# EAGLE design dualKatana (EAGLE 9.6.2)
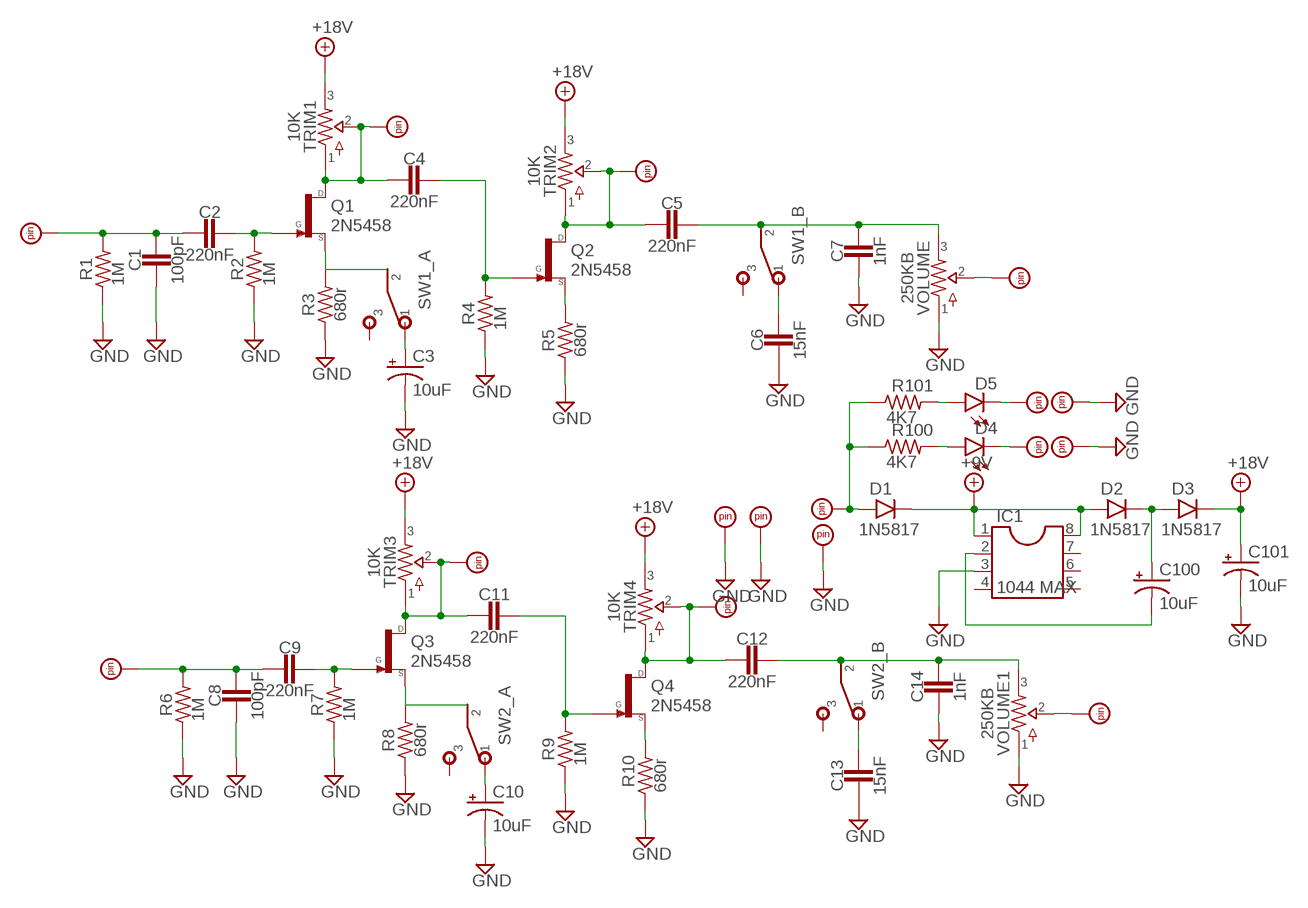
[diagram p0: schematic, sheet 1]

## Parts
C1  100pF  CAP.3  [0.2".MED]
C2  220nF  CAP.3  [0.2".MED]
C3  10uF  0501  [050_020_1]
C4  220nF  CAP.3  [0.2".MED]
C5  220nF  CAP.3  [0.2".MED]
C6  15nF  CAP.3  [0.2".MED]
C7  1nF  CAP.3  [0.2".MED]
C8  100pF  CAP.3  [0.2".MED]
C9  220nF  CAP.3  [0.2".MED]
C10  10uF  0501  [050_020_1]
C11  220nF  CAP.3  [0.2".MED]
C12  220nF  CAP.3  [0.2".MED]
C13  15nF  CAP.3  [0.2".MED]
C14  1nF  CAP.3  [0.2".MED]
C100  10uF  0501  [050_020_1]
C101  10uF  0501  [050_020_1]
D1  1N5817  DO41.3  [DO41-3]
D2  1N5817  DO41.3  [DO41-3]
D3  1N5817  DO41.3  [DO41-3]
D4  LED3MM  [LED3MM]
D5  LED3MM  [LED3MM]
IC1  1044 MAX  DIL8  [DIL08]
Q1  2N5458  2N5457  [TO92]
Q2  2N5458  2N5457  [TO92]
Q3  2N5458  2N5457  [TO92]
Q4  2N5458  2N5457  [TO92]
R1  1M  RESISTORS.3B  [R0207/3]
R2  1M  RESISTORS.3B  [R0207/3]
R3  680r  RESISTORS.3B  [R0207/3]
R4  1M  RESISTORS.3B  [R0207/3]
R5  680r  RESISTORS.3B  [R0207/3]
R6  1M  RESISTORS.3B  [R0207/3]
R7  1M  RESISTORS.3B  [R0207/3]
R8  680r  RESISTORS.3B  [R0207/3]
R9  1M  RESISTORS.3B  [R0207/3]
R10  680r  RESISTORS.3B  [R0207/3]
R100  4K7  RESISTORS.3B  [R0207/3]
R101  4K7  RESISTORS.3B  [R0207/3]
SW1  DPDTDPDT_3  [DPDT2_PCB]
SW2  DPDTDPDT_3  [DPDT2_PCB]
TRIM1  10K  TRIMMERTRIM3  [TRIM3]
TRIM2  10K  TRIMMERTRIM3  [TRIM3]
TRIM3  10K  TRIMMERTRIM3  [TRIM3]
TRIM4  10K  TRIMMERTRIM3  [TRIM3]
U$1  PADS.RND_NL  [PAD2]
U$2  PADS.RND_NL  [PAD2]
U$3  PADS.RND_NL  [PAD2]
U$4  PADS.RND_NL  [PAD2]
U$5  PADS.RND_NL  [PAD2]
U$6  PADS.RND_NL  [PAD2]
U$7  PADS.RND_NL  [PAD2]
U$8  PADS.RND_NL  [PAD2]
U$9  PADS.RND_NL  [PAD2]
U$10  PADS.RND_NL  [PAD2]
U$11  PADS.RND_NL  [PAD2]
U$12  PADS.RND_NL  [PAD2]
U$13  PADS.RND_NL  [PAD2]
U$14  PADS.RND_NL  [PAD2]
U$18  PADS.RND_NL  [PAD2]
U$19  PADS.RND_NL  [PAD2]
VOLUME  250KB  16MM.1  [16MM_B.MOUNT]
VOLUME1  250KB  16MM.1  [16MM_B.MOUNT]

## Nets
+9V: D1.C D2.A IC1.1 IC1.8
+18V: C101.+ D3.C TRIM1.3 TRIM1.6 TRIM2.3 TRIM2.6 TRIM3.3 TRIM3.6 TRIM4.3 TRIM4.6
GND: C1.2 C3.- C6.2 C7.2 C8.2 C10.- C13.2 C14.2 C101.- IC1.3 R1.1 R2.1 R3.1 R4.1 R5.1 R6.1 R7.1 R8.1 R9.1 R10.1 U$2.P$1 U$5.P$1 U$6.P$1 U$18.P$1 U$19.P$1 VOLUME1.1 VOLUME.1
N$1: D1.A R100.1 R101.1 U$1.P$1
N$2: C1.1 C2.2 R1.2 U$7.P$1
N$3: C100.- IC1.2
N$4: C100.+ D2.C D3.A
N$5: D4.A R100.2
N$6: D5.A R101.2
N$7: D4.K(C) U$3.P$1
N$8: D5.K(C) U$4.P$1
N$9: C2.1 Q1.3(G) R2.2
N$10: Q1.2(S) R3.2 SW1.A2
N$11: C3.+ SW1.A1
N$12: C4.2 Q1.1(D) TRIM1.1 TRIM1.2 TRIM1.4 TRIM1.5 U$8.P$1
N$13: C4.1 Q2.3(G) R4.2
N$14: Q2.2(S) R5.2
N$15: C5.2 Q2.1(D) TRIM2.1 TRIM2.2 TRIM2.4 TRIM2.5 U$9.P$1
N$16: C5.1 C7.1 SW1.B2 VOLUME.3
N$17: C6.1 SW1.B1
N$18: C8.1 C9.2 R6.2 U$11.P$1
N$19: U$10.P$1 VOLUME.2
N$20: C9.1 Q3.3(G) R7.2
N$21: Q3.2(S) R8.2 SW2.A2
N$22: C10.+ SW2.A1
N$23: C11.2 Q3.1(D) TRIM3.1 TRIM3.2 TRIM3.4 TRIM3.5 U$12.P$1
N$24: C11.1 Q4.3(G) R9.2
N$25: Q4.2(S) R10.2
N$26: C12.2 Q4.1(D) TRIM4.1 TRIM4.2 TRIM4.4 TRIM4.5 U$13.P$1
N$27: C12.1 C14.1 SW2.B2 VOLUME1.3
N$28: C13.1 SW2.B1
N$29: U$14.P$1 VOLUME1.2
Unconnected: IC1.4 IC1.5 IC1.6 IC1.7 SW1.A3 SW1.B3 SW2.A3 SW2.B3

## Library data of the parts
C1 C2 C4-C9 C11-C14 = caps-film:CAP: For Ceramic, Film, MLCC caps
C3 C10 C100 C101 = caps-elec:050: 0.22 - 100uF Xicon values at Mouser.com: 10V: 10 - 100uF; 16V: 2.2 - 47uF; 25V: 0.47 - 47uF; 50V: 0.22 - 22uF
D1-D3 = diodes:DO41: DO-41 Package Diodes: 1N4001 - 1N40019 Zener Diodes: 1N4728 - 1N4764
D4 D5 = diodes:LED
IC1 = integrated circuits:DIL8: Dual In Line
Q1-Q4 = transistors-FET:2N5457: 2n5457, J201, MPF102 [D]-S-G pinout, N-Channel 2n5457: http://smallbear-electronics.mybigcommerce.com/transistor-fet-2n5457/ J201: http://smallbear-electronics.mybigcommerce.com/transistor-fet-j201-national-semi/ J201: http://smallbear-electronics.mybigcommerce.com/transistor-fet-j201-vishay-siliconix/ MPF102: http://smallbear-electronics.mybigcommerce.com/transistor-fet-mpf102/
R1-R10 R100 R101 = resistors:RESISTORS
SW1 SW2 = switches:DPDT
TRIM1-TRIM4 = potentiometers:TRIMMER: Trimpots
U$1-U$14 U$18 U$19 = supply pins:PADS.: Pads For I/O connections or test point pads on PCBs.
VOLUME VOLUME1 = potentiometers:16MM: 16mm Poteniometers

## Board
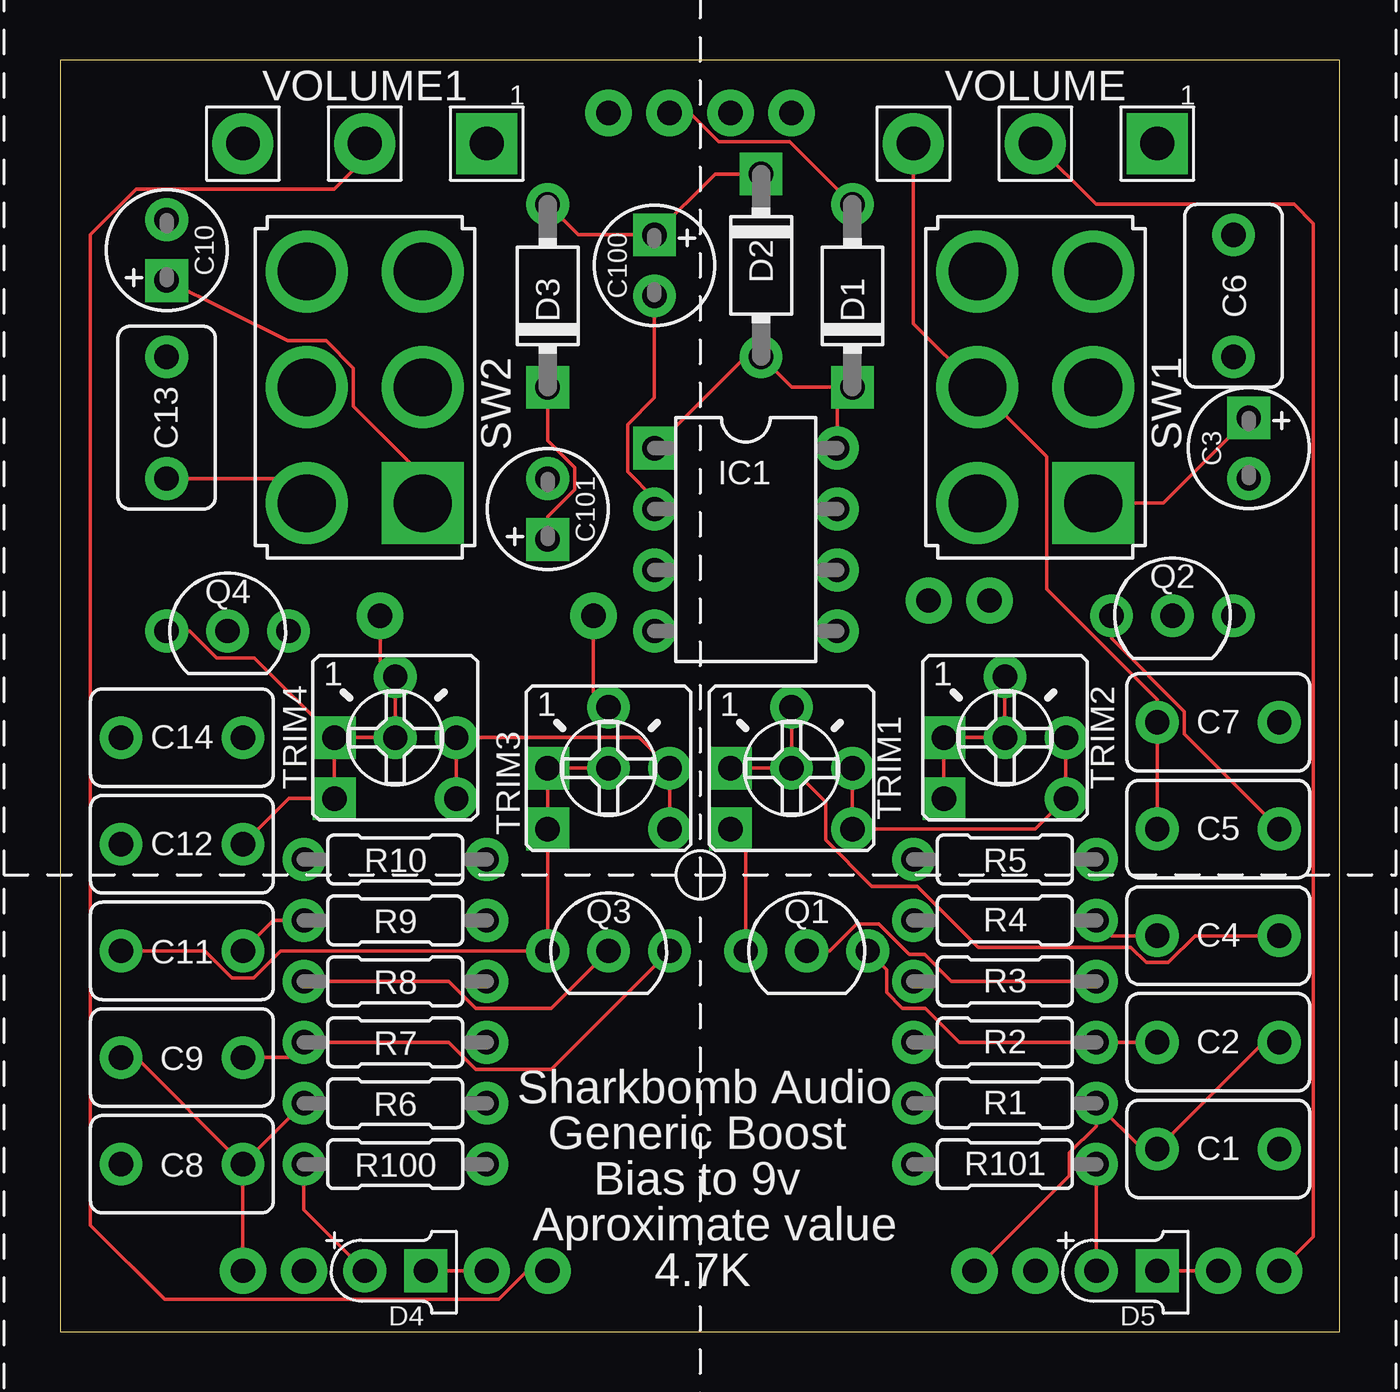
[diagram p1: board, top side]
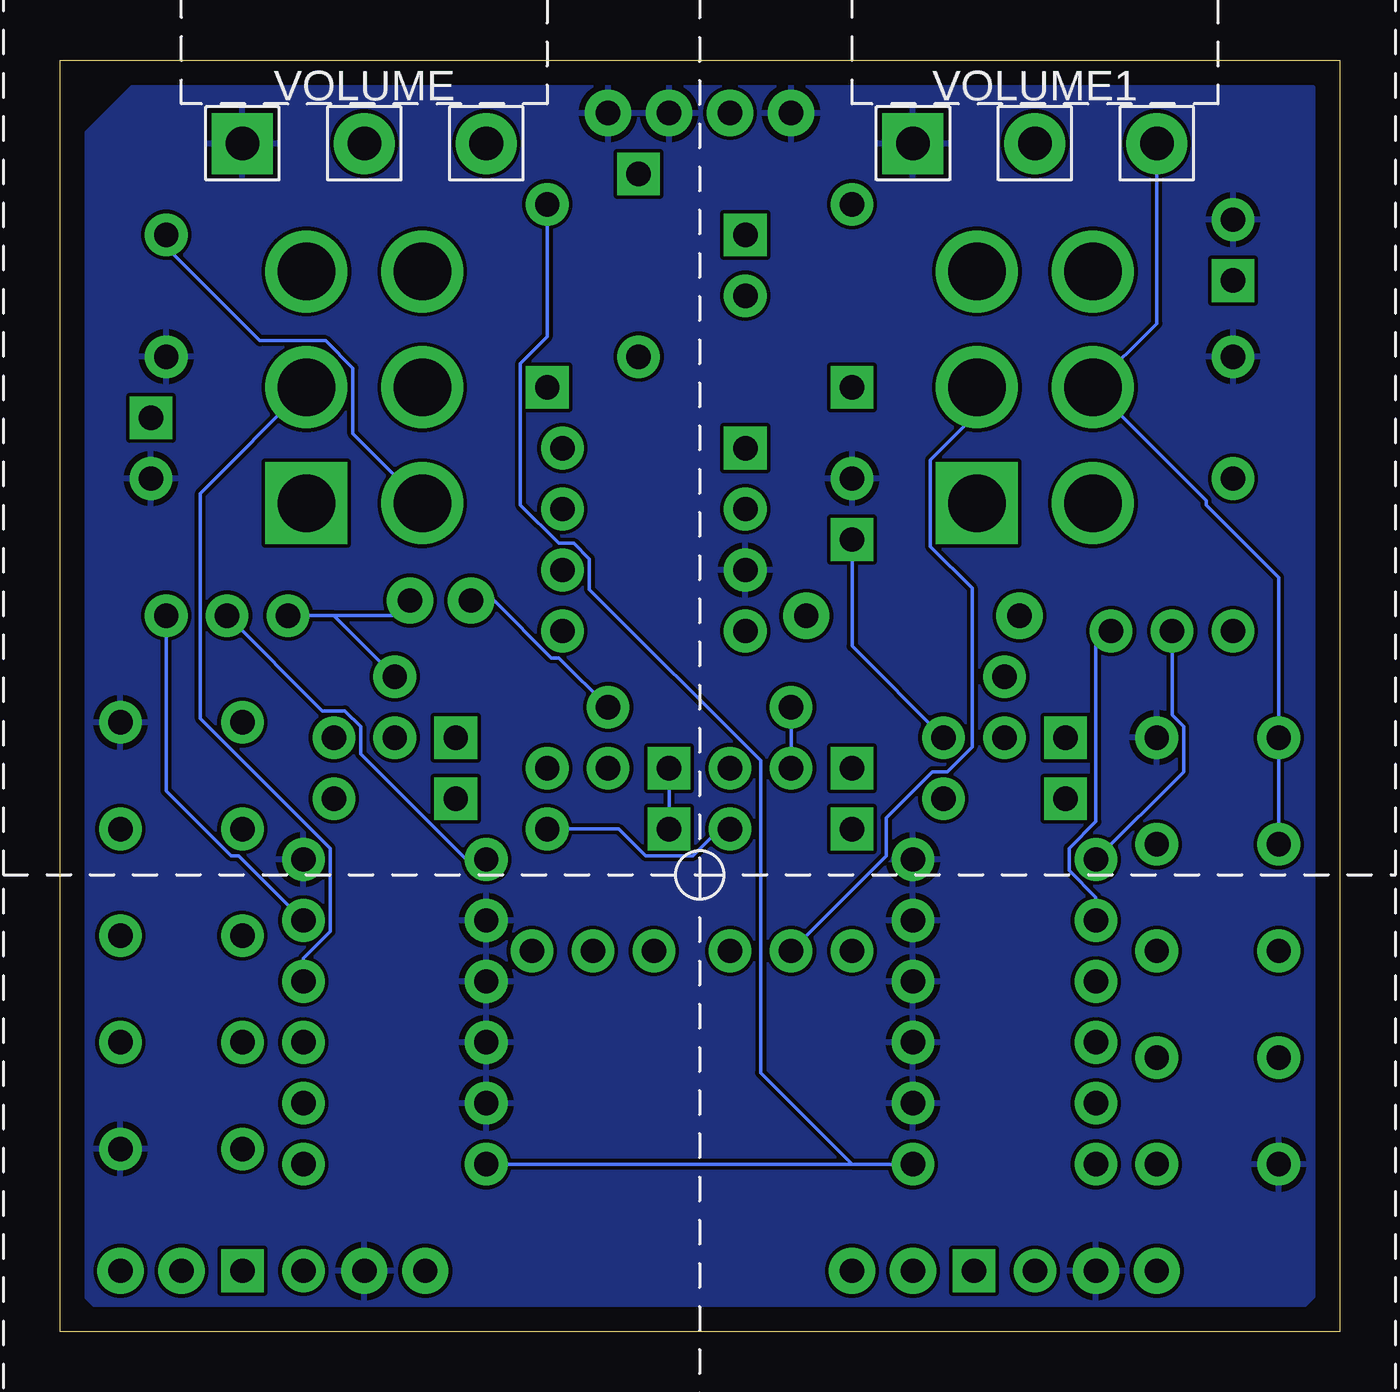
[diagram p2: board, bottom side, seen from below]

Size 53.32 x 53.01 mm. Coordinates in mm from the lower left corner, seen from the top.
Outline: 0,0 53.32,0 53.32,53.01 0,53.01 0,0
Copper layers (1*16): Top 0.035mm / dielectric 1.5mm / Bottom 0.035mm
Design rules "default": minimum track width 6mil, minimum drill 0.35mm, track to track 6mil, track to pad 6mil, pad to pad 6mil, via to via 6mil, smd to smd 6mil, copper to edge 40mil, drill to drill 6mil, minimum pad ring 10mil, minimum via ring 8mil, stop-mask expansion 4mil, vias tented up to drill 0mil, thermal gap 10mil

### Footprints (pad centres in the part's own frame; a part is rotated, then mirrored left to right if it is on the bottom)
0.2".MED = drill 1.016 pad 1.778: 1 -2.54,0; 2 2.54,0
050_020_1 = drill 1.016 pad 1.778 square: + -1.27,0 | drill 1.016 pad 1.778: - 1.27,0
DO41-3 = drill 1.016 pad 1.778: A 3.81,0 | drill 1.016 pad 1.778 square: C -3.81,0
LED3MM = drill 1.016 pad 1.778: A -1.27,0 | drill 1.016 pad 1.778 square: K 1.27,0
DIL08 = drill 1.016 pad 1.778 square: 1 -3.81,-3.81 | drill 1.016 pad 1.778: 2 -1.27,-3.81; 3 1.27,-3.81; 4 3.81,-3.81; 5 3.81,3.81; 6 1.27,3.81; 7 -1.27,3.81; 8 -3.81,3.81
TO92 = drill 1.016 pad 1.778: 1 -2.54,0; 2 0,0; 3 2.54,0
R0207/3 = drill 1.016 pad 1.778: 1 -3.81,0; 2 3.81,0
DPDT2_PCB = drill 2.4 square: A1 -2.413,4.834 | drill 2.4: A2 -2.413,0.004; A3 -2.413,-4.826; B1 2.417,4.834; B2 2.417,0.004; B3 2.417,-4.826
TRIM3 = drill 1.016 pad 1.778 square: 1 -2.54,0; 4 -2.54,-2.54 | drill 1.016 pad 1.778: 2 0,2.54; 3 2.54,0; 5 0,0; 6 2.54,-2.54
PAD2 = drill 1.016 pad 1.93: P$1 0,0
16MM_B.MOUNT = drill 1.4 pad 2.54 square: 1 5.08,0 | drill 1.4 pad 2.54: 2 0,0; 3 -5.08,0

### Placement (x,y rotation side)
C1  48.26,7.62 0 top
C2  48.26,12.06 0 top
C3  49.53,36.83 270 top
C4  48.26,16.51 0 top
C5  48.26,20.95 0 top
C6  48.9,43.18 270 top
C7  48.26,25.4 0 top
C8  5.08,6.98 180 top
C9  5.08,11.43 180 top
C10  4.45,45.08 90 top
C11  5.08,15.88 180 top
C12  5.08,20.32 0 top
C13  4.45,38.1 90 top
C14  5.08,24.77 0 top
C100  24.77,44.45 270 top
C101  20.32,34.29 90 top
D1  33.02,43.18 90 top
D2  29.21,44.45 270 top
D3  20.32,43.18 90 top
D4  13.97,2.54 0 top
D5  44.45,2.54 0 top
IC1  28.57,33.02 270 top
Q1  31.11,15.88 0 top
Q2  46.35,29.84 0 top
Q3  22.86,15.88 0 top
Q4  6.99,29.21 0 top
R1  39.37,9.52 0 top
R2  39.37,12.06 0 top
R3  39.37,14.6 0 top
R4  39.37,17.14 0 top
R5  39.37,19.69 180 top
R6  13.97,9.52 180 top
R7  13.97,12.06 180 top
R8  13.97,14.6 180 top
R9  13.97,17.14 180 top
R10  13.97,19.69 180 top
R100  13.97,6.98 180 top
R101  39.37,6.98 0 top
SW1  40.64,39.37 180 top
SW2  12.7,39.37 180 top
TRIM1  30.48,23.5 0 top
TRIM2  39.37,24.77 0 top
TRIM3  22.86,23.5 0 top
TRIM4  13.97,24.77 0 top
U$1  25.4,50.8 0 top
U$2  10.16,2.54 0 top
U$3  17.78,2.54 0 top
U$4  48.26,2.54 0 top
U$5  40.64,2.54 0 top
U$6  22.86,50.8 0 top
U$7  38.1,2.54 0 top
U$8  36.2,30.48 0 top
U$9  38.73,30.48 0 top
U$10  50.8,2.54 0 top
U$11  7.62,2.54 0 top
U$12  22.23,29.84 0 top
U$13  13.34,29.84 0 top
U$14  20.32,2.54 0 top
U$15  [125B]  26.67,19.05 0 top
U$16  [3PDT]  12.7,-20.32 0 top  (outside the outline)
U$17  [3PDT]  40.64,-20.32 0 top  (outside the outline)
U$18  30.48,50.8 0 top
U$19  27.94,50.8 0 top
U$20  [LED]  12.7,-5.08 0 top  (outside the outline)
U$21  [LED]  40.64,-5.08 0 top  (outside the outline)
VOLUME  40.64,49.53 0 top
VOLUME1  12.7,49.53 0 top

### Tracks (layer width: path | path; a pad name or v marks a point on that pad's centre or on a via)
+9V
  Top 0.152: IC1.8 32.38,38.73 D1.C 30.48,39.37 D2.A 28.57,40.64 IC1.1
+18V
  Top 0.152: TRIM1.3 TRIM1.6 40.64,20.95 TRIM2.6 TRIM2.3 | TRIM3.6 TRIM3.3 24.13,24.77 TRIM4.3 TRIM4.6 | D3.C 20.32,37.14 21.44,36.02 21.44,35.1 20.32,33.98 C101.+
  Bottom 0.152: C101.+ 20.32,28.58 TRIM4.3 | TRIM3.6 25.84,20.95 26.96,19.84 28.92,19.84 30.04,20.95 TRIM1.6
GND
  pour Bottom: 0.64,51.44 0.64,1.91 1.91,0.63 51.44,0.63 52.7,1.91 52.7,49.53 51.44,50.8 50.16,52.07 48.9,52.07 1.27,52.07
N$1
  Top 0.152: D1.A 30.4,49.61 27.45,49.61 26.25,50.8 U$1.P$1
  Bottom 0.152: D1.A 33.02,41.47 34.14,40.35 34.14,34.46 32.54,32.87 31.92,32.87 31.27,32.21 31.27,30.94 24.13,23.81 24.13,10.8 20.32,6.98 R100.1 R101.1
N$2
  Top 0.152: U$7.P$1 42.06,6.5 42.06,7.45 43.18,8.57 R1.2 45.09,7.62 C1.1 50.16,12.06 C2.2
N$3
  Top 0.152: IC1.2 24.77,34.73 23.65,35.85 23.65,37.81 24.77,38.93 C100.-
N$4
  Top 0.152: D3.A 21.59,45.72 C100.+ 27.3,48.26 D2.C
N$5
  Top 0.152: D4.A 10.16,5.08 R100.2
N$6
  Top 0.152: R101.2 D5.A
N$7
  Top 0.152: D4.K U$3.P$1
N$8
  Top 0.152: D5.K U$4.P$1
N$9
  Top 0.152: C2.1 R2.2 37.47,12.06 36.04,13.49 35.1,13.49 34.44,14.14 34.44,15.09 Q1.3
N$10
  Top 0.152: R3.2 37.14,14.6 36.02,15.72 35.39,15.72 34.12,16.99 33.19,16.99 32.07,15.88 Q1.2
  Bottom 0.152: R3.2 43.18,15.56 42.06,16.68 42.06,20.15 47.47,25.56 47.47,34.95 SW1.A2
N$11
  Top 0.152: C3.+ 45.97,34.54 SW1.A1
N$12
  Top 0.152: TRIM1.2 TRIM1.5 | TRIM1.5 TRIM1.1 | TRIM1.4 28.57,20.32 Q1.1 | C4.2 47.3,16.51 46.18,15.39 45.26,15.39 44.62,16.03 38.26,16.03 35.72,18.57 33.83,18.57 31.9,20.49 31.9,22.07 TRIM1.5
  Bottom 0.152: TRIM1.2 32.54,28.09 32.85,28.09 35.24,30.48 U$8.P$1 | TRIM1.4 TRIM1.1
N$13
  Top 0.152: C4.1 43.81,16.51 R4.2
  Bottom 0.152: R4.2 45.87,19.84 46.18,19.84 48.9,22.55 Q2.3
N$14
  Bottom 0.152: Q2.2 42.39,25.88 41.45,25.88 40.79,25.23 40.79,24.09 36.39,19.69 R5.2
N$15
  Top 0.152: C5.2 46.84,24.92 46.84,25.86 43.81,28.89 Q2.1 | TRIM2.4 TRIM2.1 TRIM2.5 TRIM2.2
  Bottom 0.152: TRIM2.2 41.91,29.84 Q2.1 39.37,29.84 U$9.P$1
N$16
  Top 0.152: C5.1 C7.1 45.72,26.36 41.12,30.96 41.12,36.47 SW1.B2 35.56,42.03 VOLUME.3
N$17
  Bottom 0.152: C6.1 48.9,45.21 44.99,41.3 42.25,41.3 41.12,40.17 41.12,37.43 SW1.B1
N$18
  Top 0.152: U$11.P$1 C8.1 | C8.1 R6.2 | C8.1 3.17,11.43 C9.2
N$19
  Top 0.152: VOLUME.2 43.18,46.99 51.44,46.99 52.23,46.2 52.23,3.97 U$10.P$1
N$20
  Top 0.152: C9.1 9.53,11.43 R7.2 16.2,12.06 17.32,10.95 20.47,10.95 Q3.3
N$21
  Top 0.152: R8.2 16.2,14.6 17.32,13.49 20.47,13.49 Q3.2
  Bottom 0.152: Q3.2 18.9,19.84 18.9,21.42 16.97,23.34 16.35,23.34 15.32,24.38 15.32,31 17.05,32.73 17.05,36.34 15.11,38.28 SW2.A2
N$22
  Top 0.152: SW2.A1 15.11,35.69 12.22,38.58 12.22,40.17 11.09,41.3 9.5,41.3 C10.+
N$23
  Top 0.152: TRIM3.5 TRIM3.1 TRIM3.4 Q3.1 9.2,15.88 8.08,14.76 7.16,14.76 6.04,15.88 C11.2 | TRIM3.2 22.23,26.67 U$12.P$1
  Bottom 0.152: TRIM3.5 TRIM3.2
N$24
  Top 0.152: C11.1 8.89,17.14 R9.2
  Bottom 0.152: Q4.3 10.16,28.58 10.16,21.27 11.28,20.15 11.28,19.22 10.16,18.1 R9.2
N$25
  Bottom 0.152: Q4.2 6.99,25.71 6.5,25.23 6.5,23.34 R10.2
N$26
  Top 0.152: C12.2 9.53,22.23 TRIM4.4 TRIM4.1 | U$13.P$1 13.34,27.94 TRIM4.2 TRIM4.5 TRIM4.1 | Q4.1 5.4,29.21 6.52,28.09 8.1,28.09 TRIM4.1
N$27
  Bottom 0.152: VOLUME1.3 7.62,42.03 SW2.B2 5.56,34.65 5.56,34.46 2.54,31.44 C14.1 C12.1
N$28
  Top 0.152: C13.1 9.26,35.56 SW2.B1
N$29
  Top 0.152: U$14.P$1 19.47,2.54 18.27,1.35 4.37,1.35 1.27,4.45 1.27,45.72 3.17,47.62 11.43,47.62 12.7,48.89 VOLUME1.2

### Text on the board
tNames: Sharkbomb Audio | Generic Boost | Bias to 9v | Aproximate value | 4.7K